# EAGLE schematic SmartPlantSensor (EAGLE 9.1.3)
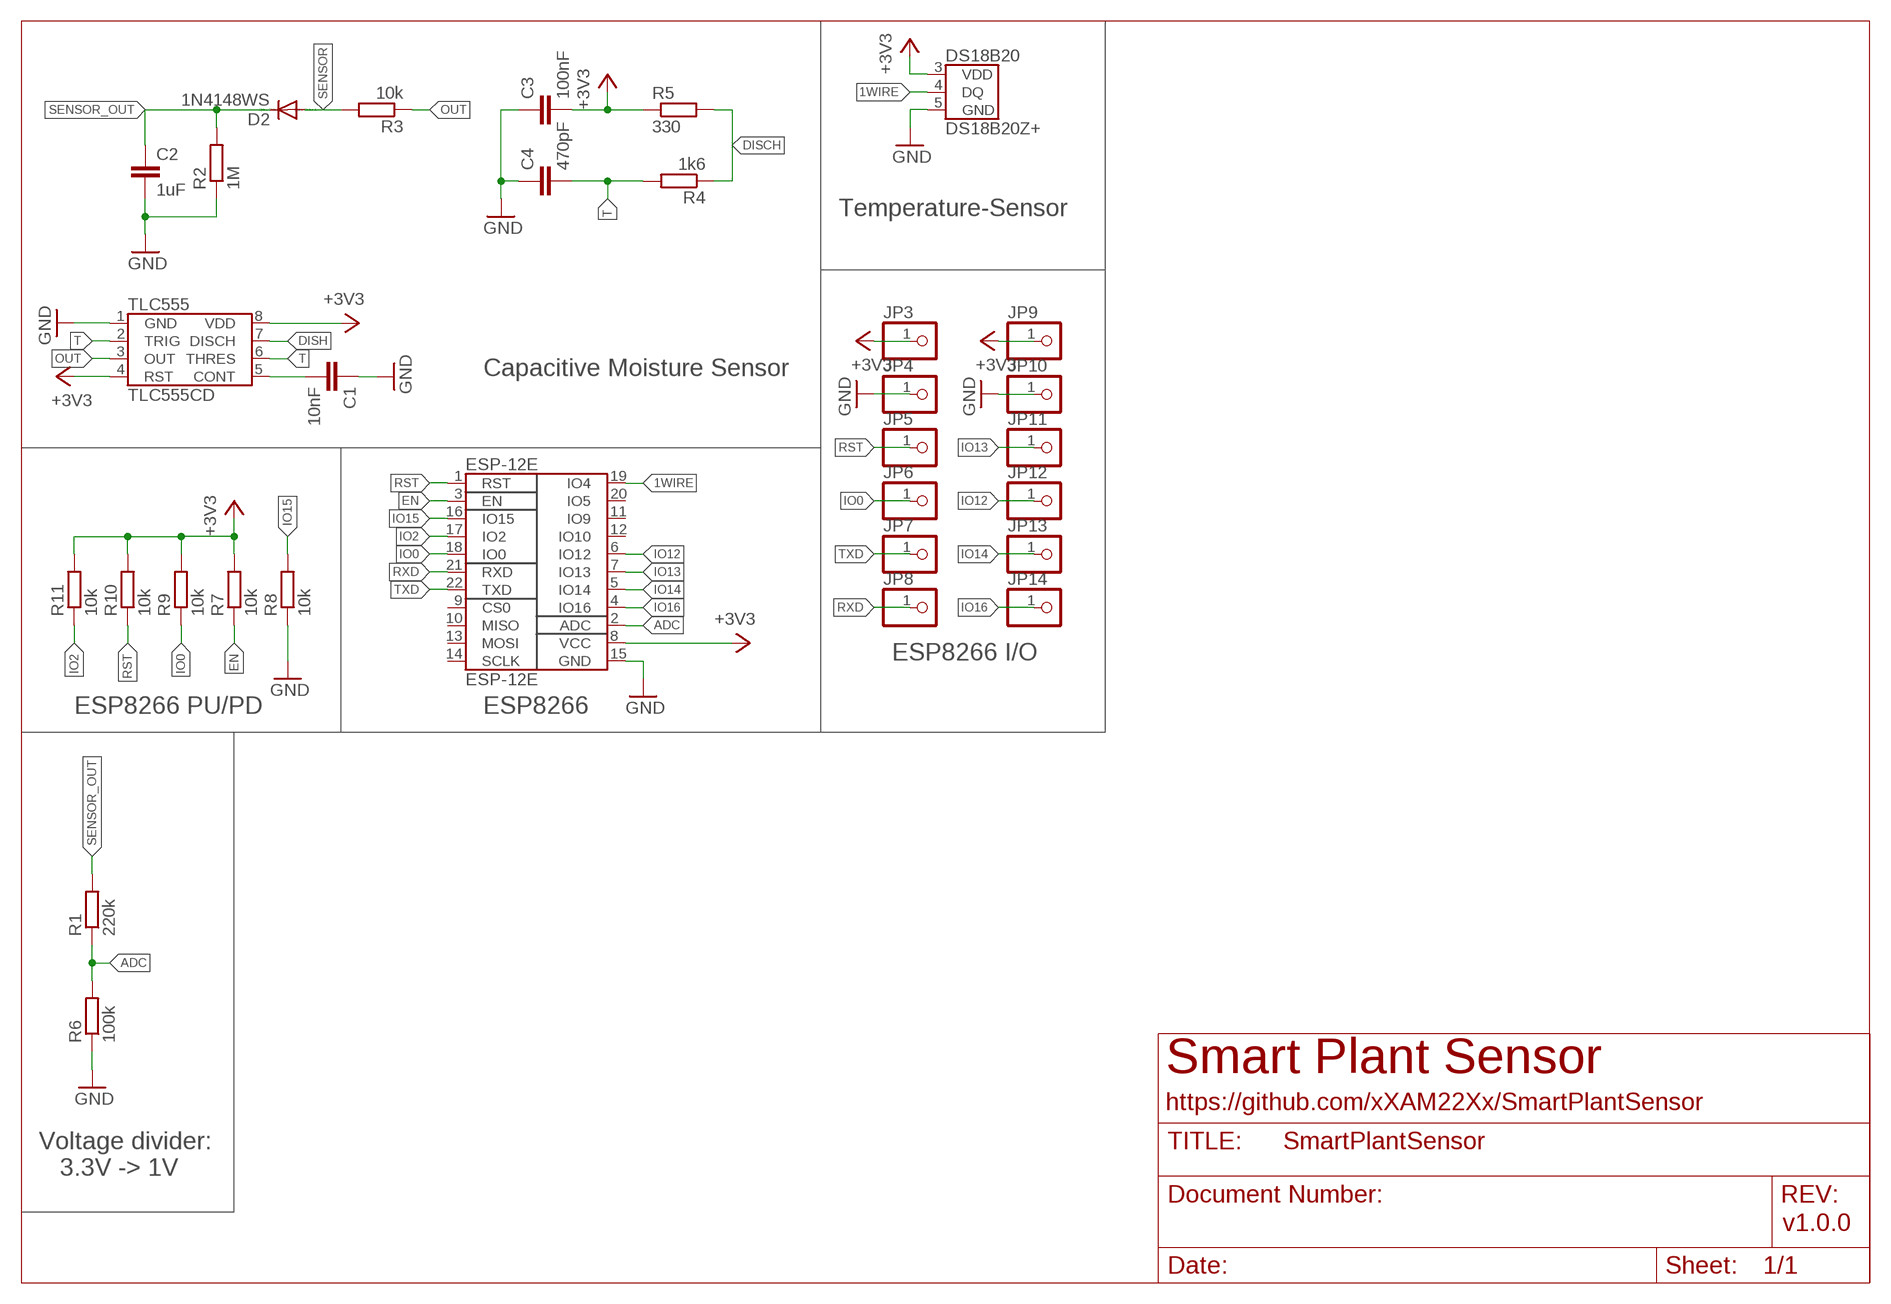
[diagram p0: schematic, sheet 1]

## Parts
C1  10nF  C-EUC0603  [C0603]
C2  1uF  C-EUC0603  [C0603]
C3  100nF  C-EUC0603  [C0603]
C4  470pF  C-EUC0603  [C0603]
D2  1N4148WS  DIODE-SOD323-R  [SOD323-R]
DS18B20  DS18B20Z+  [SOIC8]
ESP-12E  ESP-12E  [ESP-12E]
JP3  PINHD-1X1  [1X01]
JP4  PINHD-1X1  [1X01]
JP5  PINHD-1X1  [1X01]
JP6  PINHD-1X1  [1X01]
JP7  PINHD-1X1  [1X01]
JP8  PINHD-1X1  [1X01]
JP9  PINHD-1X1  [1X01]
JP10  PINHD-1X1  [1X01]
JP11  PINHD-1X1  [1X01]
JP12  PINHD-1X1  [1X01]
JP13  PINHD-1X1  [1X01]
JP14  PINHD-1X1  [1X01]
R1  220k  R-EU_R0603  [R0603]
R2  1M  R-EU_R0603  [R0603]
R3  10k  R-EU_R0603  [R0603]
R4  1k6  R-EU_R0603  [R0603]
R5  330  R-EU_R0603  [R0603]
R6  100k  R-EU_R0603  [R0603]
R7  10k  R-EU_R0603  [R0603]
R8  10k  R-EU_R0603  [R0603]
R9  10k  R-EU_R0603  [R0603]
R10  10k  R-EU_R0603  [R0603]
R11  10k  R-EU_R0603  [R0603]
TLC555  TLC555CD  [SOIC8]

## Nets
1WIRE: DS18B20.4(DQ) ESP-12E.19(IO4)
+3V3: C3.2 DS18B20.3(VDD) ESP-12E.8(VCC) JP3.1 JP9.1 R5.1 R7.2 R9.2 R10.2 R11.2 TLC555.4(RST) TLC555.8(VDD)
ADC: ESP-12E.2(ADC) R1.1 R6.2
DISCH: R4.1 R5.2
DISH: TLC555.7(DISCH)
EN: ESP-12E.3(EN) R7.1
GND: C1.1 C2.2 C3.1 C4.1 DS18B20.5(GND) ESP-12E.15(GND) JP4.1 JP10.1 R2.1 R6.1 R8.1 TLC555.1(GND)
IO0: ESP-12E.18(IO0) JP6.1 R9.1
IO2: ESP-12E.17(IO2) R11.1
IO12: ESP-12E.6(IO12) JP12.1
IO13: ESP-12E.7(IO13) JP11.1
IO14: ESP-12E.5(IO14) JP13.1
IO15: ESP-12E.16(IO15) R8.2
IO16: ESP-12E.4(IO16) JP14.1
N$1: C1.2 TLC555.5(CONT)
OUT: R3.1 TLC555.3(OUT)
RST: ESP-12E.1(RST) JP5.1 R10.1
RXD: ESP-12E.21(RXD) JP8.1
SENSOR: D2.A R3.2
SENSOR_OUT: C2.1 D2.C R1.2 R2.2
T: C4.2 R4.2 TLC555.2(TRIG) TLC555.6(THRES)
TXD: ESP-12E.22(TXD) JP7.1
Unconnected: ESP-12E.9(CS0) ESP-12E.10(MISO) ESP-12E.11(IO9) ESP-12E.12(IO10) ESP-12E.13(MOSI) ESP-12E.14(SCLK) ESP-12E.20(IO5)

## Notes on the sheet
- Temperature-Sensor
- Capacitive Moisture Sensor
- ESP8266 I/O
- ESP8266 PU/PD | ESP8266
- Smart Plant Sensor
- https://github.com/xXAM22Xx/SmartPlantSensor
- Voltage divider:
     3.3V -> 1V
- v1.0.0

## Library data of the parts
C1-C4 = rcl:C-EU: CAPACITOR, European symbol; SPICEPREFIX: C
D2 = diode:DIODE-: DIODE
DS18B20 = MaximIntegrated:DS18B20
ESP-12E = ESP:ESP-12E
JP3-JP14 = pinhead:PINHD-1X1: PIN HEADER
R1-R11 = rcl:R-EU_: RESISTOR, European symbol; SPICEPREFIX: R
TLC555 = TexasInstruments:TLC555